# EAGLE design 515+pcb+8 (EAGLE 9.7.0)
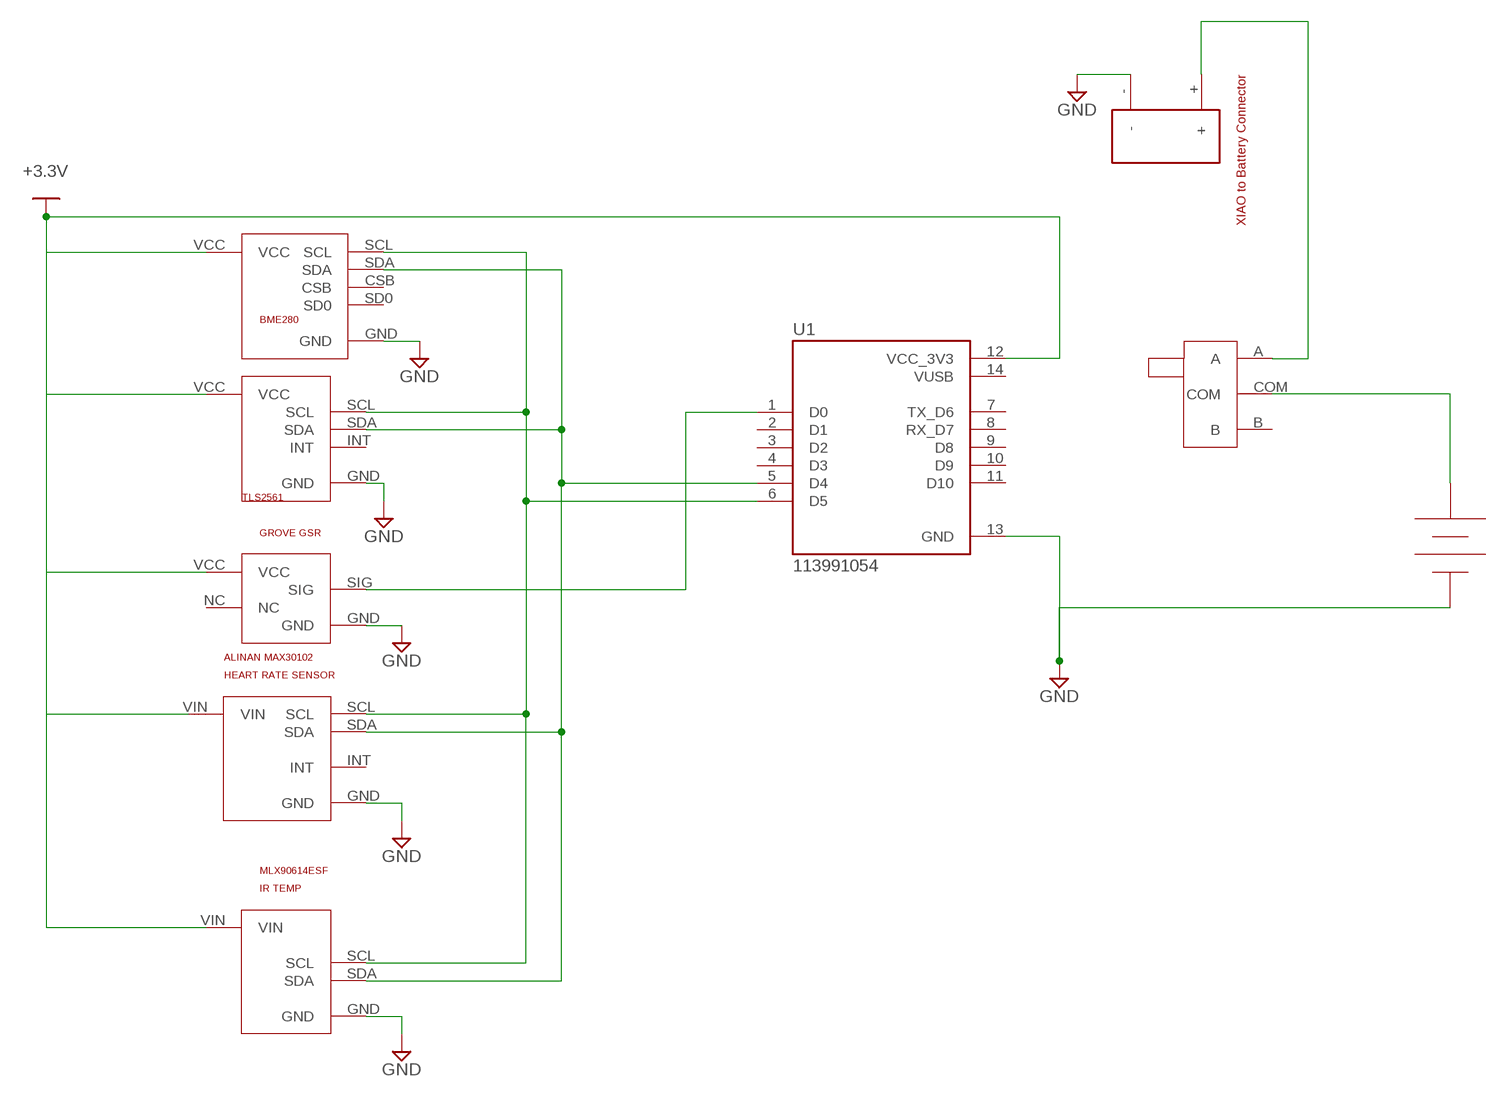
[diagram p0: schematic, sheet 1]

## Parts
U1  113991054  [MODULE_113991054]
U$1  POWER_BREAKOUT  [POWER_BREAKOUT]
U$2  GROVE_GSR  [GROVE_GSR]
U$3  BME280  [BME280]
U$4  MLX90614ESF  [MLX90614ESF]
U$5  TLS2561  [TSL2561]
U$6  MAX30102_ALINAN  [MAX30102_ALINAN]
U$7  LIPO_BATTERY  [JST_PH]
U$8  SPST_SWITCH  [SPST_SWITCH]

## Nets
+3.3V: U1.12(VCC_3V3) U$2.VCC U$3.VCC U$4.VIN U$5.VCC U$6.VIN
GND: U1.13(GND) U$1.- U$2.GND U$3.GND U$4.GND U$5.GND U$6.GND U$7.GND(NEG)
N$1: U1.6(D5) U$3.SCL U$4.SCL U$5.SCL U$6.SCL
N$2: U1.5(D4) U$3.SDA U$4.SDA U$5.SDA U$6.SDA
N$3: U1.1(D0) U$2.SIG
N$4: U$7.POS U$8.COM
N$5: U$1.+ U$8.A
Unconnected: U1.2(D1) U1.3(D2) U1.4(D3) U1.7(TX_D6) U1.8(RX_D7) U1.9(D8) U1.10(D9) U1.11(D10) U$2.NC U$3.CSB U$3.SD0 U$5.INT U$6.INT U$8.B

## Power pins joined to a net without a drawn wire
VUSB: U1.14(VUSB)

## Library data of the parts
U1 = 113991054:113991054; MANUFACTURER: Seeed Technology; MAXIMUM_PACKAGE_HEIGHT: N/A; PARTREV: 23/05/2022; SNAPEDA_PN: 113991054; STANDARD: Manufacturer Recommendations
U$1 = 515 PowerBreakout:POWER_BREAKOUT
U$2 = GIX:GROVE_GSR
U$3 = GIX:BME280
U$4 = GIX (1):MLX90614ESF
U$5 = GIX:TLS2561
U$6 = GIX (1):MAX30102_ALINAN
U$7 = GIX:LIPO_BATTERY
U$8 = GIX:SPST_SWITCH

## Board
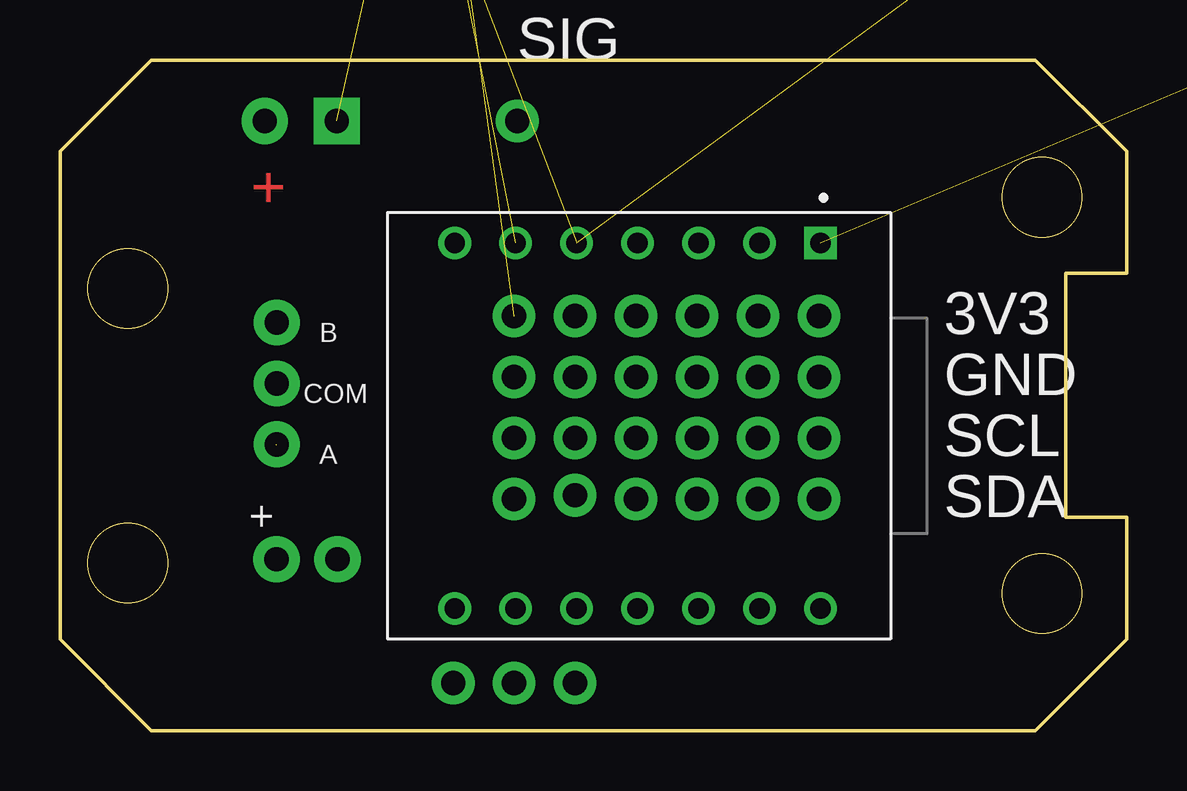
[diagram p1: board, top side]
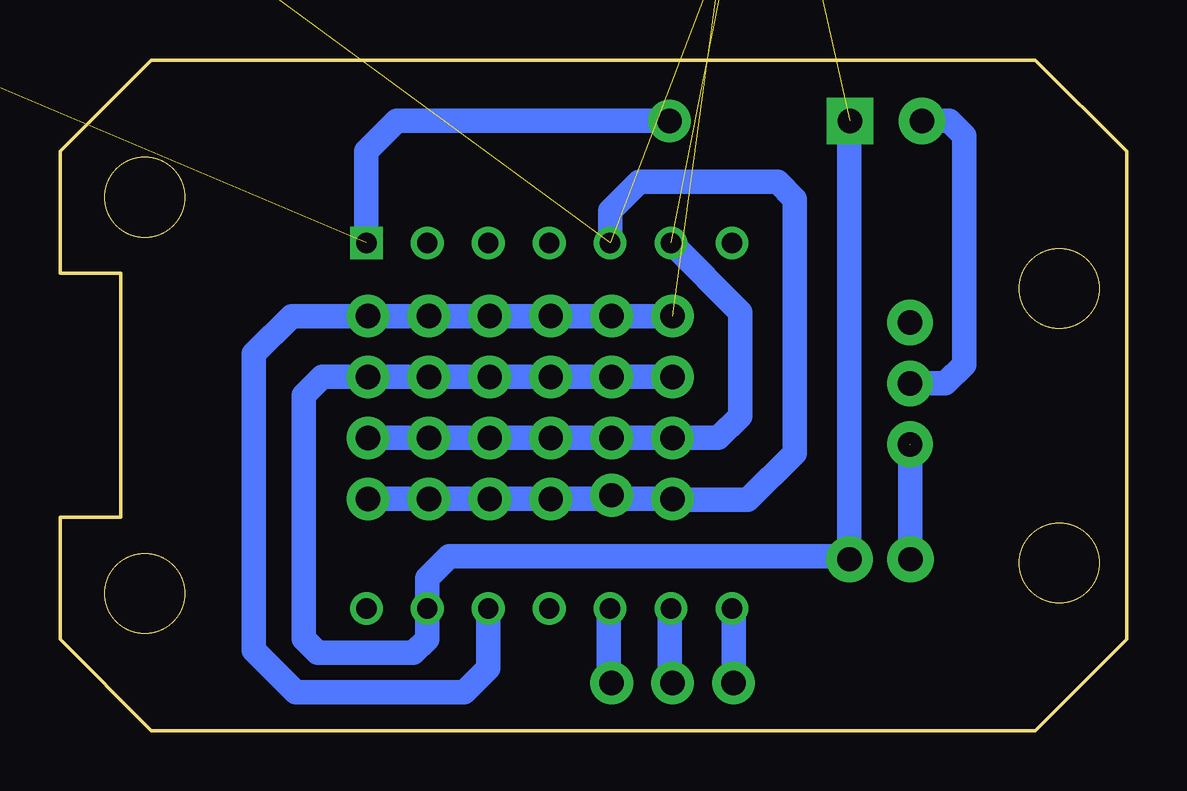
[diagram p2: board, bottom side, seen from below]

Size 44.45 x 27.94 mm. Coordinates in mm from the lower left corner, seen from the top.
Outline: 44.45,8.89 44.45,3.81 40.64,0 3.81,0 0,3.81 0,24.13 3.81,27.94 40.64,27.94 44.45,24.13 44.45,19.05 41.91,19.05 41.91,8.89 44.45,8.89
Outline: circle at 2.82,18.41 radius 1.67
Outline: circle at 2.82,6.99 radius 1.67
Outline: circle at 40.92,22.23 radius 1.67
Outline: circle at 40.92,5.71 radius 1.67
Copper layers (1*16): Top / Bottom
Stack-up Default Layer Stack: Top User Defined 0.035mm / Dielectric-1 User Defined 1.5mm / Bottom User Defined 0.035mm
Design rules "default": minimum track width 6mil, minimum drill 0.35mm, track to track 6mil, track to pad 6mil, pad to pad 6mil, via to via 6mil, smd to smd 6mil, copper to edge 40mil, drill to drill 6mil, minimum pad ring 10mil, minimum via ring 8mil, stop-mask expansion 4mil, vias tented up to drill 0mil, thermal gap 10mil

### Footprints (pad centres in the part's own frame; a part is rotated, then mirrored left to right if it is on the bottom)
MODULE_113991054 = drill 0.85 square: 1 -7.62,7.556 | drill 0.85: 2 -7.62,5.016; 3 -7.62,2.477; 4 -7.62,-0.064; 5 -7.62,-2.603; 6 -7.62,-5.144; 7 -7.62,-7.684; 8 7.62,-7.684; 9 7.62,-5.144; 10 7.62,-2.603; 11 7.62,-0.064; 12 7.62,2.477; 13 7.62,5.016; 14 7.62,7.556
POWER_BREAKOUT = drill 1.016 pad 1.93: + 0,1.27; - 0,-1.27
GROVE_GSR = drill 1.016 pad 1.778: GND 0,3.81; NC 0,-1.27; SIG 0,-3.81; VCC 0,1.27
BME280 = drill 1.016 pad 1.778: CSB 0,-3.81; SCL 0,1.27; SD0 0,-6.35; SDA 0,-1.27; VCC 0,6.35 | drill 1.016 pad 1.778 square: GND 0,3.81
MLX90614ESF = drill 1.016 pad 1.778: GND 0,1.27; SCL 0,-1.27; SDA 0,-3.81; VIN 0,3.81
TSL2561 = drill 1.016 pad 1.778 square: GND 0,2.54 | drill 1.016 pad 1.778: INT 0,-5.08; SCL 0,0; SDA 0,-2.54; VCC 0,5.08
MAX30102_ALINAN = drill 1.016 pad 1.778: GND 0,2.54; INT 0,-5.08; SCL 0,0; SDA 0,-2.54; VIN 0,5.08
JST_PH = drill 1.016 pad 1.93 square: GND 0,-1.5 | drill 1.016 pad 1.93: POS 0,1.5
SPST_SWITCH = drill 1.016 pad 1.905: A 0,2.54; B 0,-2.54; COM 0,0

### Placement (x,y rotation side)
U1  24.13,12.7 270 top
U$1  10.29,7.14 90 top
U$2  73.66,41.91 0 top  (outside the outline)
U$3  54.61,39.37 0 top  (outside the outline)
U$4  45.72,41.91 0 bottom  (outside the outline)
U$5  -17.78,40.64 0 top  (outside the outline)
U$6  15.24,39.37 0 bottom  (outside the outline)
U$7  10.03,25.4 90 top
U$8  9.03,14.47 180 top

### Tracks (layer width: path | path; a pad name or v marks a point on that pad's centre or on a via)
+3.3V  (via drill 1.02 pad 1.78)  (5 unrouted)
  Bottom 1.016: U1.12 26.61,2.6 27.61,1.6 34.62,1.6 36.37,3.35 36.37,15.7 34.8,17.27 v31.62,17.27 v29.08,17.27 v26.54,17.27 v24,17.27 v21.46,17.27 v18.92,17.27
GND  (via drill 1.02 pad 1.78)  (5 unrouted)
  Bottom 1.016: U$7.GND 11.56,25.38 U$1.- 11.68,7.26 28.23,7.26 29.15,6.35 U1.13 29.15,3.81 29.72,3.23 33.71,3.23 34.3,3.82 34.3,13.96 33.53,14.73 v31.62,14.73 v29.08,14.73 v26.54,14.73 v24,14.73 v21.46,14.73 v18.92,14.73
N$1  (via drill 1.02 pad 1.78)  (4 unrouted)
  Bottom 1.016: v31.62,12.19 v29.08,12.19 v26.54,12.19 v24,12.19 v21.46,12.19 v18.92,12.19 17.02,12.19 16.1,13.11 16.1,17.44 U1.6
N$2  (via drill 1.02 pad 1.78)  (4 unrouted)
  Bottom 1.016: U1.5 21.53,21.65 20.32,22.86 14.55,22.86 13.84,22.14 13.84,11.56 15.79,9.61 18.88,9.61 v18.92,9.65 21.31,9.65 v21.46,9.8 21.61,9.65 v24,9.65 v26.54,9.65 v29.08,9.65 v31.62,9.65
N$3  (via drill 1.02 pad 1.78)  (1 unrouted)
  Bottom 1.016: U1.1 31.69,24.13 30.42,25.4 v19.05,25.4
N$4
  Bottom 1.016: U$7.POS 7.39,25.4 6.78,24.79 6.78,15.24 7.56,14.46 U$8.COM
N$5  (1 unrouted)
  Bottom 1.016: U$1.+ 9.02,11.91
N$6  (via drill 1.02 pad 1.78)
  Bottom 1.016: v16.38,1.98 16.38,4.95 16.51,5.08
N$7  (via drill 1.02 pad 1.78)
  Bottom 1.016: v18.92,1.98 19.05,2.11 19.05,5.08
N$8  (via drill 1.02 pad 1.78)
  Bottom 1.016: v21.46,1.98 21.59,2.11 21.59,5.08

### Text on the board
tNames: SIG | 3V3 | 3V3 | GND | SCL | SDA | GND